# Altium schematic sheet NetworkSwitch.SchDoc
size A2; Organization: Altium Limited; Address1: L3, 12a Rodborough Rd; Address2: Frenchs Forest; Address3: NSW; Address4: Australia 2086
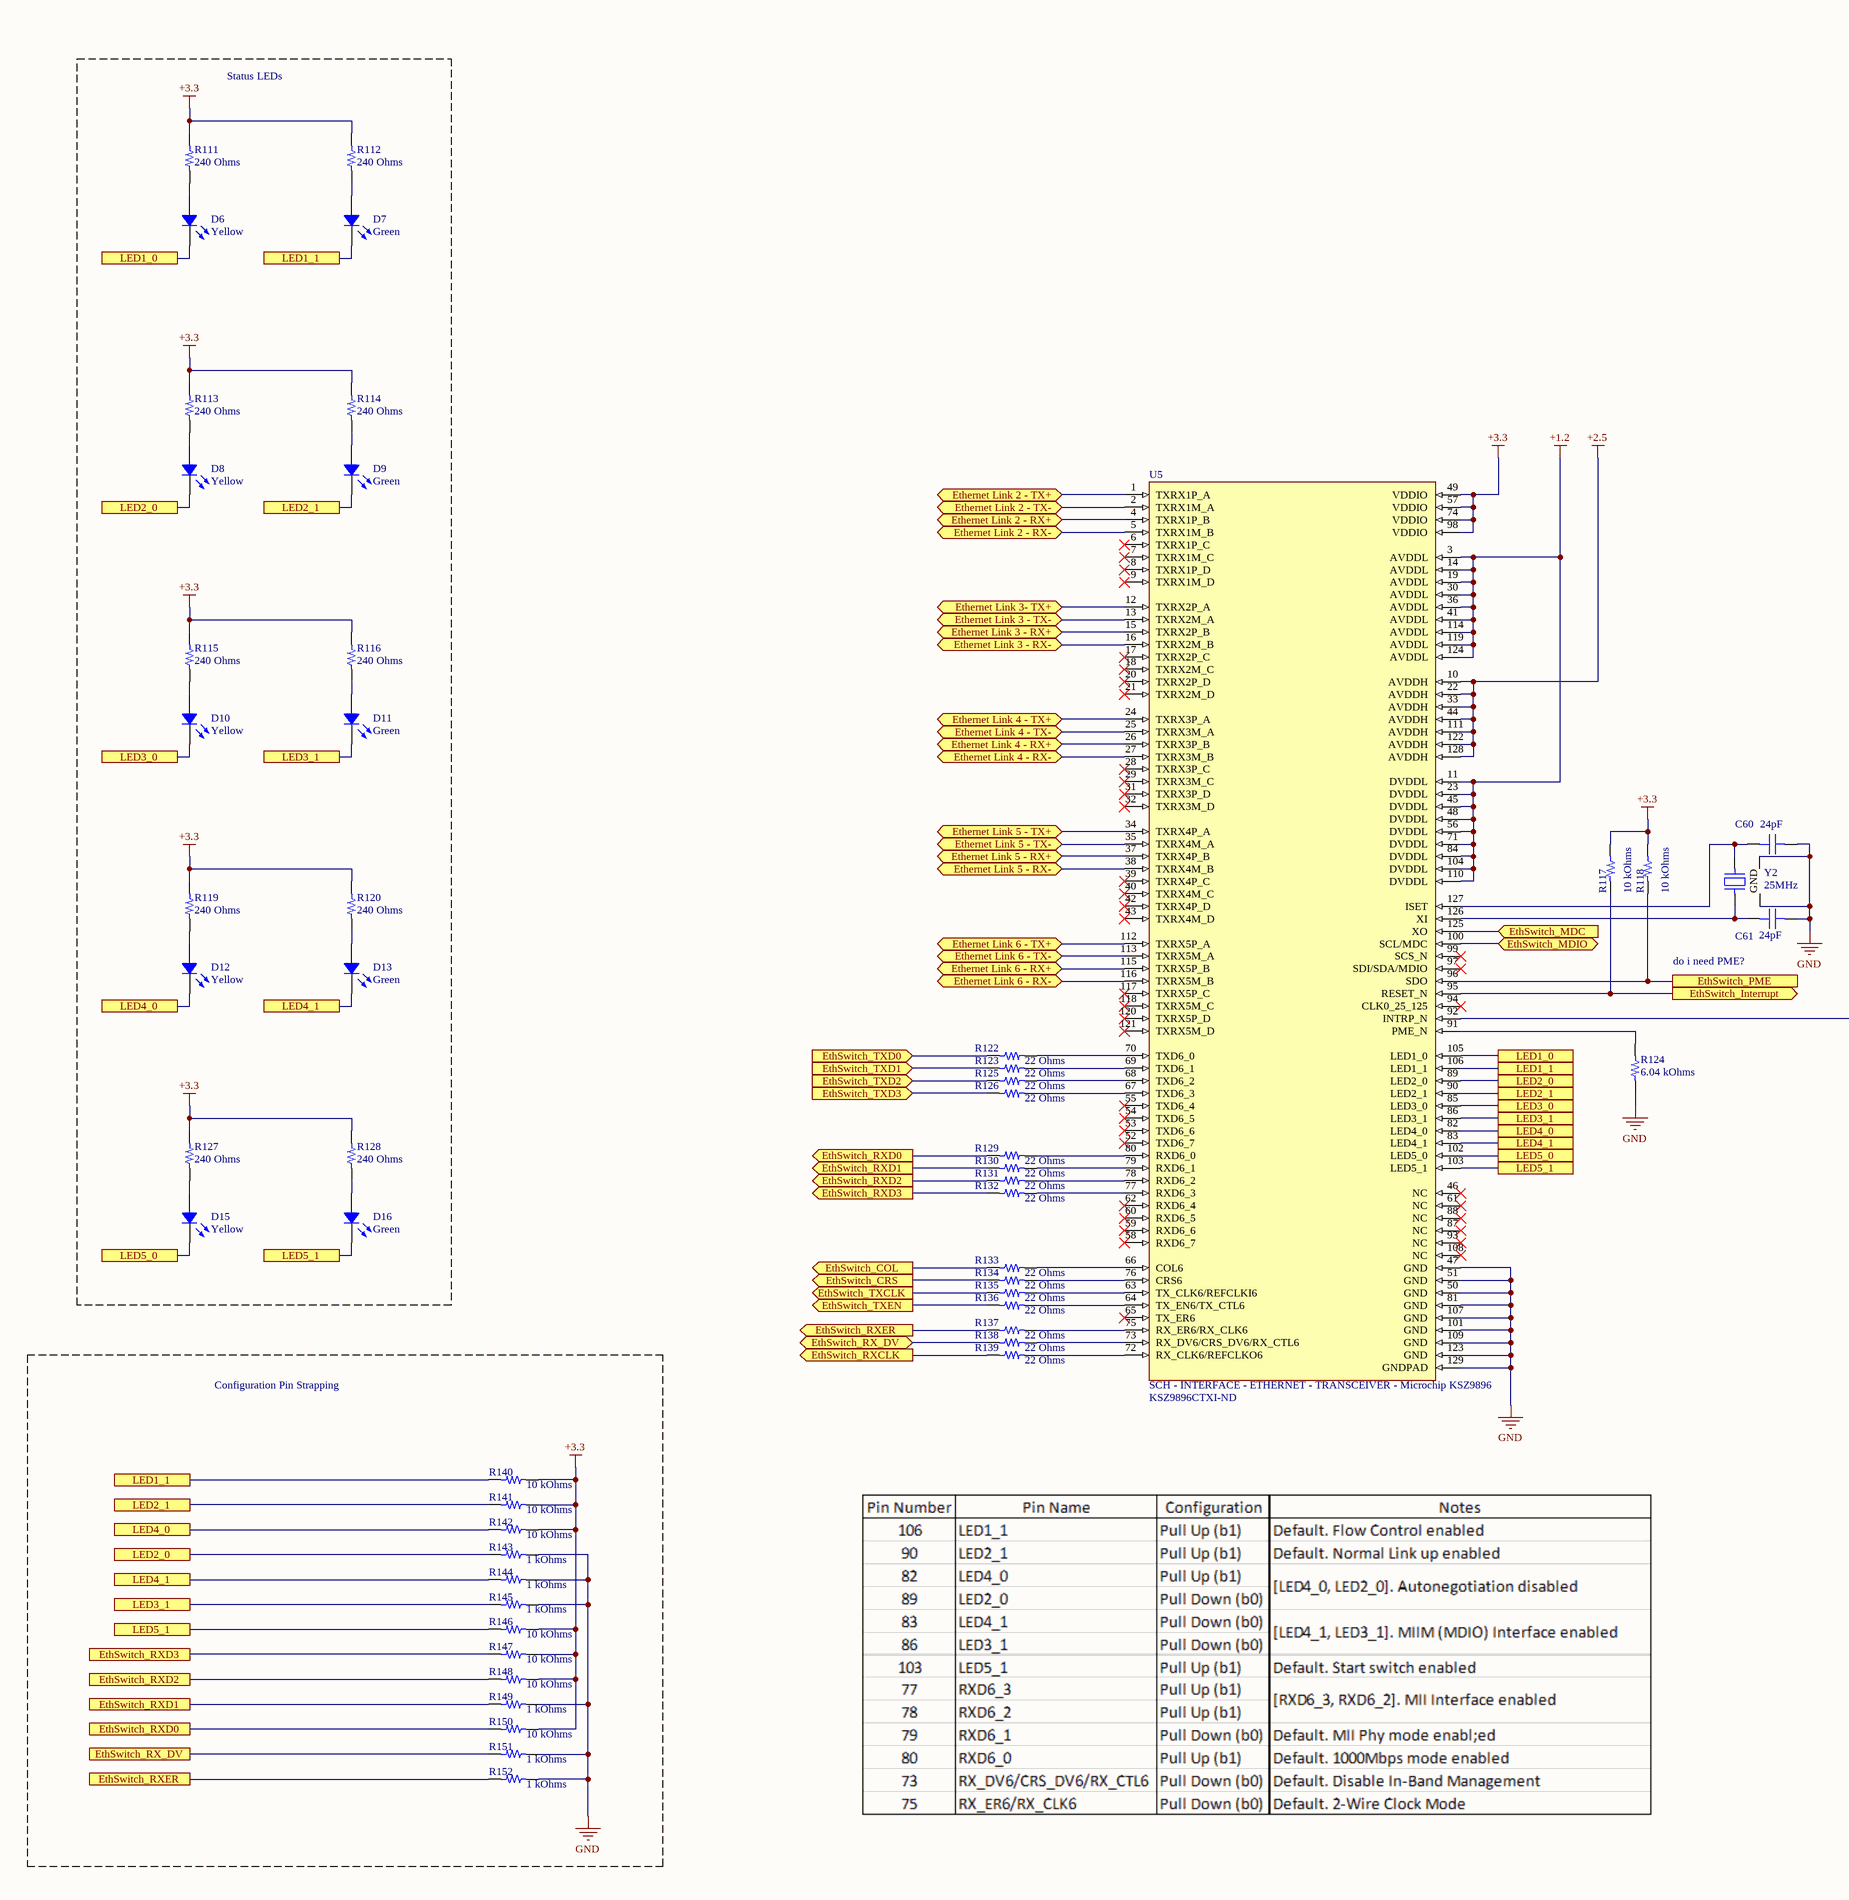
[diagram p0: NetworkSwitch.SchDoc, left]
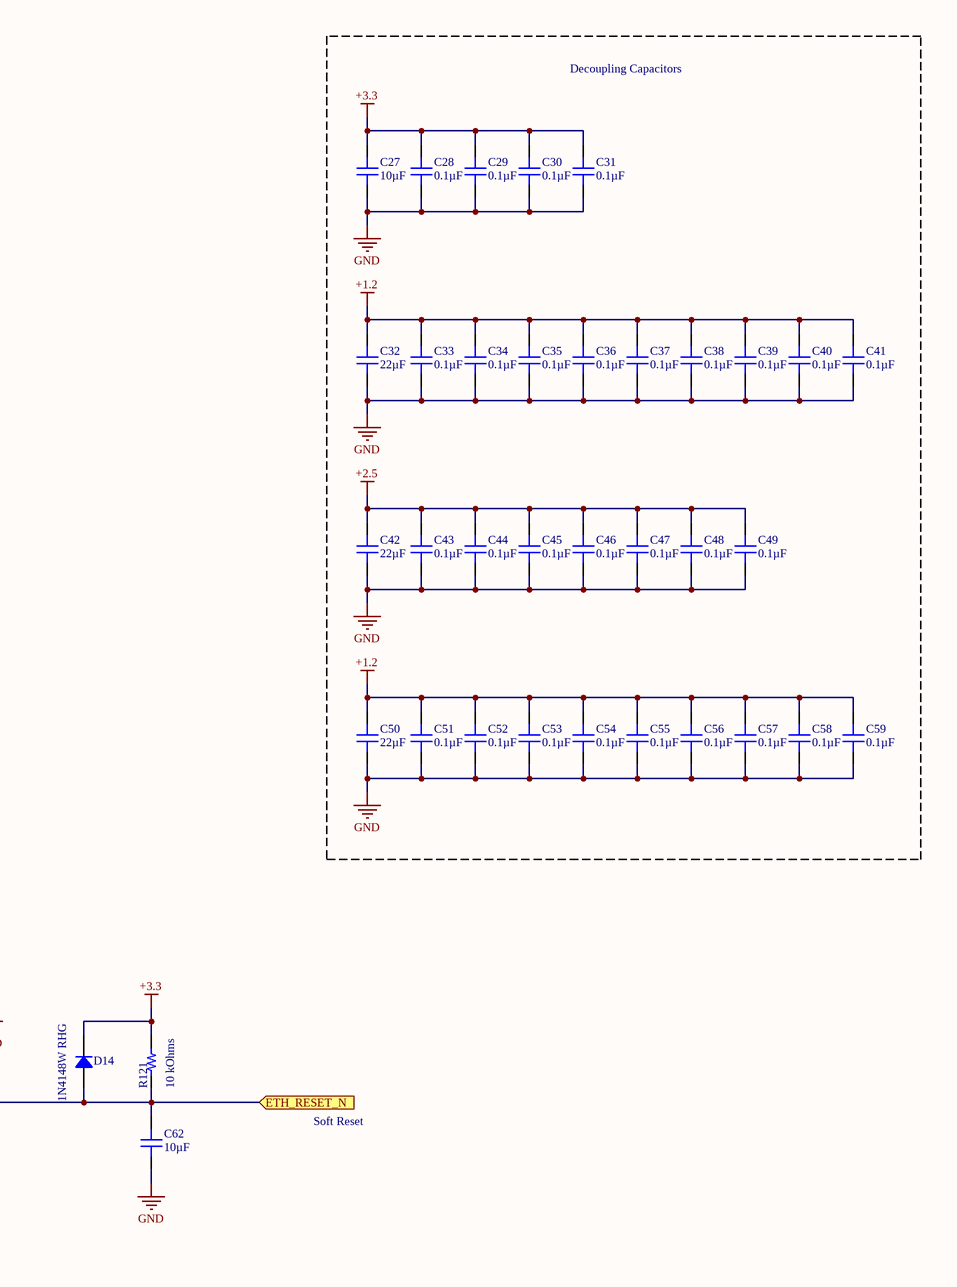
[diagram p1: NetworkSwitch.SchDoc, right]

## Parts
C27  10µF  [CAP 0805_2012]
C28  0.1µF  [CAP 0603_1608]
C29  0.1µF  [CAP 0603_1608]
C30  0.1µF  [CAP 0603_1608]
C31  0.1µF  [CAP 0603_1608]
C32  22µF  [CAP 0805_2012]
C33  0.1µF  [CAP 0603_1608]
C34  0.1µF  [CAP 0603_1608]
C35  0.1µF  [CAP 0603_1608]
C36  0.1µF  [CAP 0603_1608]
C37  0.1µF  [CAP 0603_1608]
C38  0.1µF  [CAP 0603_1608]
C39  0.1µF  [CAP 0603_1608]
C40  0.1µF  [CAP 0603_1608]
C41  0.1µF  [CAP 0603_1608]
C42  22µF  [CAP 0805_2012]
C43  0.1µF  [CAP 0603_1608]
C44  0.1µF  [CAP 0603_1608]
C45  0.1µF  [CAP 0603_1608]
C46  0.1µF  [CAP 0603_1608]
C47  0.1µF  [CAP 0603_1608]
C48  0.1µF  [CAP 0603_1608]
C49  0.1µF  [CAP 0603_1608]
C50  22µF  [CAP 0805_2012]
C51  0.1µF  [CAP 0603_1608]
C52  0.1µF  [CAP 0603_1608]
C53  0.1µF  [CAP 0603_1608]
C54  0.1µF  [CAP 0603_1608]
C55  0.1µF  [CAP 0603_1608]
C56  0.1µF  [CAP 0603_1608]
C57  0.1µF  [CAP 0603_1608]
C58  0.1µF  [CAP 0603_1608]
C59  0.1µF  [CAP 0603_1608]
C60  24pF  [CAP 0603_1608]
C61  24pF  [CAP 0603_1608]
C62  10µF  [CAP 0805_2012]
D6  Yellow  [LED 0603_1608 YELLOW]
D7  Green  [LED 0603_1608 GREEN]
D8  Yellow  [LED 0603_1608 YELLOW]
D9  Green  [LED 0603_1608 GREEN]
D10  Yellow  [LED 0603_1608 YELLOW]
D11  Green  [LED 0603_1608 GREEN]
D12  Yellow  [LED 0603_1608 YELLOW]
D13  Green  [LED 0603_1608 GREEN]
D14  1N4148W RHG  [SOD123F]
D15  Yellow  [LED 0603_1608 YELLOW]
D16  Green  [LED 0603_1608 GREEN]
R111  240 Ohms  [RES 0603_1608]
R112  240 Ohms  [RES 0603_1608]
R113  240 Ohms  [RES 0603_1608]
R114  240 Ohms  [RES 0603_1608]
R115  240 Ohms  [RES 0603_1608]
R116  240 Ohms  [RES 0603_1608]
R117  10 kOhms  [RES 0603_1608]
R118  10 kOhms  [RES 0603_1608]
R119  240 Ohms  [RES 0603_1608]
R120  240 Ohms  [RES 0603_1608]
R121  10 kOhms  [RES 0603_1608]
R122  22 Ohms  [RES 0603_1608]
R123  22 Ohms  [RES 0603_1608]
R124  6.04 kOhms  [RES 0603_1608]
R125  22 Ohms  [RES 0603_1608]
R126  22 Ohms  [RES 0603_1608]
R127  240 Ohms  [RES 0603_1608]
R128  240 Ohms  [RES 0603_1608]
R129  22 Ohms  [RES 0603_1608]
R130  22 Ohms  [RES 0603_1608]
R131  22 Ohms  [RES 0603_1608]
R132  22 Ohms  [RES 0603_1608]
R133  22 Ohms  [RES 0603_1608]
R134  22 Ohms  [RES 0603_1608]
R135  22 Ohms  [RES 0603_1608]
R136  22 Ohms  [RES 0603_1608]
R137  22 Ohms  [RES 0603_1608]
R138  22 Ohms  [RES 0603_1608]
R139  22 Ohms  [RES 0603_1608]
R140  10 kOhms  [RES 0603_1608]
R141  10 kOhms  [RES 0603_1608]
R142  10 kOhms  [RES 0603_1608]
R143  1 kOhms  [RES 0603_1608]
R144  1 kOhms  [RES 0603_1608]
R145  1 kOhms  [RES 0603_1608]
R146  10 kOhms  [RES 0603_1608]
R147  10 kOhms  [RES 0603_1608]
R148  10 kOhms  [RES 0603_1608]
R149  1 kOhms  [RES 0603_1608]
R150  10 kOhms  [RES 0603_1608]
R151  1 kOhms  [RES 0603_1608]
R152  1 kOhms  [RES 0603_1608]
U5  SCH - INTERFACE - ETHERNET - TRANSCEIVER - Microchip KSZ9896  Supplier Part Number 1: KSZ9896CTXI-ND  [PCB - LEADS - QFP - Microchip 128-TQFP]
Y2  25MHz  [EPSON TSX-3225]

## Blocks framed on the sheet
Status LEDs: D6-D13 D15 D16 R111-R116 R119 R120 R127 R128
Decoupling Capacitors: C27-C59
Configuration Pin Strapping: R140-R152

## Ports
ETH_RESET_N (in), Ethernet Link 2 - RX+ (bidir), Ethernet Link 2 - RX- (bidir), Ethernet Link 2 - TX+ (bidir), Ethernet Link 2 - TX- (bidir), Ethernet Link 3 - RX+ (bidir), Ethernet Link 3 - RX- (bidir), Ethernet Link 3 - TX- (bidir), Ethernet Link 3- TX+ (bidir), Ethernet Link 4 - RX+ (bidir), Ethernet Link 4 - RX- (bidir), Ethernet Link 4 - TX+ (bidir), Ethernet Link 4 - TX- (bidir), Ethernet Link 5 - RX+ (bidir), Ethernet Link 5 - RX- (bidir), Ethernet Link 5 - TX+ (bidir), Ethernet Link 5 - TX- (bidir), Ethernet Link 6 - RX+ (bidir), Ethernet Link 6 - RX- (bidir), Ethernet Link 6 - TX+ (bidir), Ethernet Link 6 - TX- (bidir), EthSwitch_COL (out), EthSwitch_CRS (out), EthSwitch_Interrupt (out), EthSwitch_MDC (in), EthSwitch_MDIO (bidir), EthSwitch_PME, EthSwitch_RX_DV, EthSwitch_RX_DV (bidir), EthSwitch_RXCLK (out), EthSwitch_RXD0, EthSwitch_RXD0 (out), EthSwitch_RXD1, EthSwitch_RXD1 (out), EthSwitch_RXD2, EthSwitch_RXD2 (out), EthSwitch_RXD3, EthSwitch_RXD3 (out), EthSwitch_RXER, EthSwitch_RXER (out), EthSwitch_TXCLK (out), EthSwitch_TXD0 (in), EthSwitch_TXD1 (in), EthSwitch_TXD2 (in), EthSwitch_TXD3 (in), EthSwitch_TXEN (out), LED1_0, LED1_1, LED2_0, LED2_1, LED3_0, LED3_1, LED4_0, LED4_1, LED5_0, LED5_1

## Nets
+1.2: C32.2 C33.2 C34.2 C35.2 C36.2 C37.2 C38.2 C39.2 C40.2 C41.2 C50.2 C51.2 C52.2 C53.2 C54.2 C55.2 C56.2 C57.2 C58.2 C59.2 U5.3(AVDDL) U5.11(DVDDL) U5.14(AVDDL) U5.19(AVDDL) U5.23(DVDDL) U5.30(AVDDL) U5.36(AVDDL) U5.41(AVDDL) U5.45(DVDDL) U5.48(DVDDL) U5.56(DVDDL) U5.71(DVDDL) U5.84(DVDDL) U5.104(DVDDL) U5.110(DVDDL) U5.114(AVDDL) U5.119(AVDDL) U5.124(AVDDL)
+2.5: C42.2 C43.2 C44.2 C45.2 C46.2 C47.2 C48.2 C49.2 U5.10(AVDDH) U5.22(AVDDH) U5.33(AVDDH) U5.44(AVDDH) U5.111(AVDDH) U5.122(AVDDH) U5.128(AVDDH)
+3.3: C27.2 C28.2 C29.2 C30.2 C31.2 D14.2 R111.2 R112.2 R113.2 R114.2 R115.2 R116.2 R117.2 R118.2 R119.2 R120.2 R121.2 R127.2 R128.2 R140.1 R141.1 R142.1 R146.1 R147.1 R148.1 R150.1 U5.49(VDDIO) U5.57(VDDIO) U5.74(VDDIO) U5.98(VDDIO)
GND: C27.1 C28.1 C29.1 C30.1 C31.1 C32.1 C33.1 C34.1 C35.1 C36.1 C37.1 C38.1 C39.1 C40.1 C41.1 C42.1 C43.1 C44.1 C45.1 C46.1 C47.1 C48.1 C49.1 C50.1 C51.1 C52.1 C53.1 C54.1 C55.1 C56.1 C57.1 C58.1 C59.1 C60.2 C61.2 C62.1 R124.1 R143.1 R144.1 R145.1 R149.1 R151.1 R152.1 U5.47(GND) U5.50(GND) U5.51(GND) U5.81(GND) U5.101(GND) U5.107(GND) U5.109(GND) U5.123(GND) U5.129(GNDPAD) Y2.2(GND) Y2.4(GND)
ETH_RESET_N: C62.2 D14.1 R121.1 U5.92(INTRP_N) ; port ETH_RESET_N
Ethernet Link 2 - RX+: U5.4(TXRX1P_B) ; port Ethernet Link 2 - RX+
Ethernet Link 2 - RX-: U5.5(TXRX1M_B) ; port Ethernet Link 2 - RX-
Ethernet Link 2 - TX+: U5.1(TXRX1P_A) ; port Ethernet Link 2 - TX+
Ethernet Link 2 - TX-: U5.2(TXRX1M_A) ; port Ethernet Link 2 - TX-
Ethernet Link 3 - RX+: U5.15(TXRX2P_B) ; port Ethernet Link 3 - RX+
Ethernet Link 3 - RX-: U5.16(TXRX2M_B) ; port Ethernet Link 3 - RX-
Ethernet Link 3 - TX-: U5.13(TXRX2M_A) ; port Ethernet Link 3 - TX-
Ethernet Link 3- TX+: U5.12(TXRX2P_A) ; port Ethernet Link 3- TX+
Ethernet Link 4 - RX+: U5.26(TXRX3P_B) ; port Ethernet Link 4 - RX+
Ethernet Link 4 - RX-: U5.27(TXRX3M_B) ; port Ethernet Link 4 - RX-
Ethernet Link 4 - TX+: U5.24(TXRX3P_A) ; port Ethernet Link 4 - TX+
Ethernet Link 4 - TX-: U5.25(TXRX3M_A) ; port Ethernet Link 4 - TX-
Ethernet Link 5 - RX+: U5.37(TXRX4P_B) ; port Ethernet Link 5 - RX+
Ethernet Link 5 - RX-: U5.38(TXRX4M_B) ; port Ethernet Link 5 - RX-
Ethernet Link 5 - TX+: U5.34(TXRX4P_A) ; port Ethernet Link 5 - TX+
Ethernet Link 5 - TX-: U5.35(TXRX4M_A) ; port Ethernet Link 5 - TX-
Ethernet Link 6 - RX+: U5.115(TXRX5P_B) ; port Ethernet Link 6 - RX+
Ethernet Link 6 - RX-: U5.116(TXRX5M_B) ; port Ethernet Link 6 - RX-
Ethernet Link 6 - TX+: U5.112(TXRX5P_A) ; port Ethernet Link 6 - TX+
Ethernet Link 6 - TX-: U5.113(TXRX5M_A) ; port Ethernet Link 6 - TX-
EthSwitch_COL: R133.1 ; port EthSwitch_COL
EthSwitch_CRS: R134.1 ; port EthSwitch_CRS
EthSwitch_Interrupt: R117.1 U5.95(RESET_N) ; port EthSwitch_Interrupt
EthSwitch_MDC: U5.125(XO) ; port EthSwitch_MDC
EthSwitch_MDIO: U5.100(SCL/MDC) ; port EthSwitch_MDIO
EthSwitch_PME: R118.1 U5.96(SDO) ; port EthSwitch_PME
EthSwitch_RX_DV: R138.1 R151.2 ; port EthSwitch_RX_DV
EthSwitch_RXCLK: R139.1 ; port EthSwitch_RXCLK
EthSwitch_RXD0: R129.1 R150.2 ; port EthSwitch_RXD0
EthSwitch_RXD1: R130.1 R149.2 ; port EthSwitch_RXD1
EthSwitch_RXD2: R131.1 R148.2 ; port EthSwitch_RXD2
EthSwitch_RXD3: R132.1 R147.2 ; port EthSwitch_RXD3
EthSwitch_RXER: R137.1 R152.2 ; port EthSwitch_RXER
EthSwitch_TXCLK: R135.1 ; port EthSwitch_TXCLK
EthSwitch_TXD0: R122.1 ; port EthSwitch_TXD0
EthSwitch_TXD1: R123.1 ; port EthSwitch_TXD1
EthSwitch_TXD2: R125.1 ; port EthSwitch_TXD2
EthSwitch_TXD3: R126.1 ; port EthSwitch_TXD3
EthSwitch_TXEN: R136.1 ; port EthSwitch_TXEN
LED1_0: D6.2 U5.105(LED1_0) ; port LED1_0
LED1_1: D7.2 R140.2 U5.106(LED1_1) ; port LED1_1
LED2_0: D8.2 R143.2 U5.89(LED2_0) ; port LED2_0
LED2_1: D9.2 R141.2 U5.90(LED2_1) ; port LED2_1
LED3_0: D10.2 U5.85(LED3_0) ; port LED3_0
LED3_1: D11.2 R145.2 U5.86(LED3_1) ; port LED3_1
LED4_0: D12.2 R142.2 U5.82(LED4_0) ; port LED4_0
LED4_1: D13.2 R144.2 U5.83(LED4_1) ; port LED4_1
LED5_0: D15.2 U5.102(LED5_0) ; port LED5_0
LED5_1: D16.2 R146.2 U5.103(LED5_1) ; port LED5_1
NetC60_1: C60.1 U5.127(ISET) Y2.3
NetC61_1: C61.1 U5.126(XI) Y2.1
NetD6_1: D6.1 R111.1
NetD7_1: D7.1 R112.1
NetD8_1: D8.1 R113.1
NetD9_1: D9.1 R114.1
NetD10_1: D10.1 R115.1
NetD11_1: D11.1 R116.1
NetD12_1: D12.1 R119.1
NetD13_1: D13.1 R120.1
NetD15_1: D15.1 R127.1
NetD16_1: D16.1 R128.1
NetR122_2: R122.2 U5.70(TXD6_0)
NetR123_2: R123.2 U5.69(TXD6_1)
NetR124_2: R124.2 U5.91(PME_N)
NetR125_2: R125.2 U5.68(TXD6_2)
NetR126_2: R126.2 U5.67(TXD6_3)
NetR129_2: R129.2 U5.80(RXD6_0)
NetR130_2: R130.2 U5.79(RXD6_1)
NetR131_2: R131.2 U5.78(RXD6_2)
NetR132_2: R132.2 U5.77(RXD6_3)
NetR133_2: R133.2 U5.66(COL6)
NetR134_2: R134.2 U5.76(CRS6)
NetR135_2: R135.2 U5.63(TX_CLK6/REFCLKI6)
NetR136_2: R136.2 U5.64(TX_EN6/TX_CTL6)
NetR137_2: R137.2 U5.75(RX_ER6/RX_CLK6)
NetR138_2: R138.2 U5.73(RX_DV6/CRS_DV6/RX_CTL6)
NetR139_2: R139.2 U5.72(RX_CLK6/REFCLKO6)

Not connected (* = marked no-connect by the designer): U5 6(TXRX1P_C)* 7(TXRX1M_C)* 8(TXRX1P_D)* 9(TXRX1M_D)* 17(TXRX2P_C)* 18(TXRX2M_C)* 20(TXRX2P_D)* 21(TXRX2M_D)* 28(TXRX3P_C)* 29(TXRX3M_C)* 31(TXRX3P_D)* 32(TXRX3M_D)* 39(TXRX4P_C)* 40(TXRX4M_C)* 42(TXRX4P_D)* 43(TXRX4M_D)* 46(NC)* 52(TXD6_7)* 53(TXD6_6)* 54(TXD6_5)* 55(TXD6_4)* 58(RXD6_7)* 59(RXD6_6)* 60(RXD6_5)* 61(NC)* 62(RXD6_4)* 65(TX_ER6)* 87(NC)* 88(NC)* 93(NC)* 94(CLK0_25_125)* 97(SDI/SDA/MDIO)* 99(SCS_N)* 108(NC)* 117(TXRX5P_C)* 118(TXRX5M_C)* 120(TXRX5P_D)* 121(TXRX5M_D)*

## Notes on the sheet
- (near C61) do i need PME?
- Soft Reset
- Title
- Size:
- Date:
- File:
- A2
- Number:
- Time:
- Revision:
- Sheet
- of

## Library data of the parts
C27 C62 = CC0805KKX5R7BB106: CAP CER 10UF 16V X5R 0805; Manufacturer: Yageo; Tolerance: ±10%; Part Number: CC0805KKX5R7BB106; Value: 10µF; Applications: General Purpose; Capacitance: 10µF; ComponentLink1Description: Datasheet; ComponentLink1URL: https://www.yageo.com/upload/media/product/productsearch/datasheet/mlcc/UPY-GPHC_X5R_4V-to-50V_25.pdf; ComponentLink2Description: DigiKey Link; ComponentLink2URL: http://digikey.com/product-detail/en/yageo/CC0805KKX5R7BB106/311-1865-1-ND/5195767; Device Package: 0805 (2012 Metric); LastUpdated: 9/2/2020 1:04:30 AM; Lifecycle Status: Active; Minimum Order: 1; Mounting Type: Surface Mount, MLCC; Operating Temperature: -55°C ~ 85°C; Package / Case: 0805 (2012 Metric); Packaging: TapeAndReel; PartId: 8867; Part Status: Active; Price: 0.09; Series: CC; Size / Dimension: 0.079" L x 0.049" W (2.00mm x 1.25mm); Supplier 1: DigiKey; Supplier Part Number 1: 311-1865-1-ND; Temperature Coefficient: X5R; Thickness (Max): 0.057" (1.45mm); Voltage - Rated: 16V
C28-C31 C33-C41 C43-C49 C51-C59 = CL10B104KA8WPNC: CAP CER 0.1UF 25V X7R 0603; Manufacturer: Samsung Electro-Mechanics; Tolerance: ±10%; Part Number: CL10B104KA8WPNC; Value: 0.1µF; Applications: Automotive; Capacitance: 0.1µF; ComponentLink1Description: Datasheet; ComponentLink1URL: http://www.samsungsem.com/kr/support/product-search/mlcc/CL10B104KA8WPNC.jsp; ComponentLink2Description: DigiKey Link; ComponentLink2URL: http://digikey.com/product-detail/en/samsung-electro-mechanics/CL10B104KA8WPNC/1276-6717-1-ND/5961576; Device Package: 0603 (1608 Metric); Features: Open Mode; LastUpdated: 9/2/2020 1:03:30 AM; Lifecycle Status: Active; Minimum Order: 1; Mounting Type: Surface Mount, MLCC; Operating Temperature: -55°C ~ 125°C; Package / Case: 0603 (1608 Metric); Packaging: TapeAndReel; PartId: 5631; Part Status: Active; Price: 0.02; Ratings: AEC-Q200; Series: CL; Size / Dimension: 0.063" L x 0.031" W (1.60mm x 0.80mm); Supplier 1: DigiKey; Supplier Part Number 1: 1276-6717-1-ND; Temperature Coefficient: X7R; Thickness (Max): 0.035" (0.90mm); Voltage - Rated: 25V
C32 C42 C50 = CL21A226KPCLRNC: CAP CER 22UF 10V X5R 0805; Manufacturer: Samsung Electro-Mechanics; Tolerance: ±10%; Part Number: CL21A226KPCLRNC; Value: 22µF; Applications: General Purpose; Capacitance: 22µF; ComponentLink1Description: Datasheet; ComponentLink1URL: http://www.samsungsem.com/kr/support/product-search/mlcc/CL21A226KPCLRNC.jsp; ComponentLink2Description: DigiKey Link; ComponentLink2URL: http://digikey.com/product-detail/en/samsung-electro-mechanics/CL21A226KPCLRNC/1276-6786-1-ND/5961645; Device Package: 0805 (2012 Metric); Features: Low Profile; LastUpdated: 9/2/2020 1:04:38 AM; Lifecycle Status: Active; Minimum Order: 1; Mounting Type: Surface Mount, MLCC; Operating Temperature: -55°C ~ 85°C; Package / Case: 0805 (2012 Metric); Packaging: TapeAndReel; PartId: 4833; Part Status: Active; Price: 0.08; Series: CL; Size / Dimension: 0.079" L x 0.049" W (2.00mm x 1.25mm); Supplier 1: DigiKey; Supplier Part Number 1: 1276-6786-1-ND; Temperature Coefficient: X5R; Thickness (Max): 0.037" (0.95mm); Voltage - Rated: 10V
C60 C61 = CL10C240JB8NNNC: CAP CER 24PF 50V C0G/NP0 0603; Manufacturer: Samsung Electro-Mechanics; Temperature Coefficient: C0G, NP0; Tolerance: ±5%; Part Number: CL10C240JB8NNNC; Value: 24pF; Applications: General Purpose; Capacitance: 24pF; ComponentLink1Description: Datasheet; ComponentLink1URL: http://www.samsungsem.com/kr/support/product-search/mlcc/CL10C240JB8NNNC.jsp; ComponentLink2Description: DigiKey Link; ComponentLink2URL: http://digikey.com/product-detail/en/samsung-electro-mechanics/CL10C240JB8NNNC/1276-1761-1-ND/3889847; Device Package: 0603 (1608 Metric); LastUpdated: 9/2/2020 1:03:22 AM; Lifecycle Status: Active; Minimum Order: 1; Mounting Type: Surface Mount, MLCC; Operating Temperature: -55°C ~ 125°C; Package / Case: 0603 (1608 Metric); Packaging: TapeAndReel; PartId: 10003; Part Status: Active; Price: 0.01; Series: CL; Size / Dimension: 0.063" L x 0.031" W (1.60mm x 0.80mm); Supplier 1: DigiKey; Supplier Part Number 1: 1276-1761-1-ND; Thickness (Max): 0.035" (0.90mm); Voltage - Rated: 50V
D6 D8 D10 D12 D15 = LTST-C194KSKT: LED YELLOW CLEAR SMD; Manufacturer: Lite-On Inc.; Configuration: Standard; Current - Test: 20mA; Lens Color: Colorless; Lens Size: 1.15mm x 0.80mm; Lens Style: Rectangle with Flat Top; Millicandela Rating: 104mcd; Viewing Angle: 130°; Voltage - Forward (Vf) (Typ): 2V; Wavelength - Dominant: 592nm; Wavelength - Peak: 588nm; Part Number: LTST-C194KSKT; Color: Yellow; ComponentLink1Description: Datasheet; ComponentLink1URL: http://optoelectronics.liteon.com/upload/download/DS22-2006-114/LTST-C194KSKT.PDF; ComponentLink2Description: DigiKey Link; ComponentLink2URL: http://digikey.com/product-detail/en/lite-on-inc/LTST-C194KSKT/160-1836-1-ND/2356234; Device Package: 0603 (1608 Metric); Height (Max): 0.45mm; LastUpdated: 9/2/2020 1:21:17 AM; Lens Transparency: Clear; Lifecycle Status: Active; Minimum Order: 1; Mounting Type: Surface Mount; Package / Case: 0603 (1608 Metric); Packaging: TapeAndReel; PartId: 148; Part Status: Active; Price: 0.06; Series: -; Size / Dimension: 1.60mm L x 0.80mm W; Supplier 1: DigiKey; Supplier Part Number 1: 160-1836-1-ND; Value: Yellow
D7 D9 D11 D13 D16 = LTST-C193KGKT-5A: LED GREEN CLEAR CHIP SMD; Manufacturer: Lite-On Inc.; Configuration: Standard; Current - Test: 5mA; Lens Color: Colorless; Lens Size: 1.15mm x 0.80mm; Lens Style: Rectangle with Flat Top; Millicandela Rating: 16.25mcd; Viewing Angle: 130°; Voltage - Forward (Vf) (Typ): 2V; Wavelength - Dominant: 572nm; Wavelength - Peak: 574nm; Part Number: LTST-C193KGKT-5A; Color: Green; ComponentLink1Description: Datasheet; ComponentLink1URL: http://optoelectronics.liteon.com/upload/download/DS22-2007-0094/LTST-C193KGKT-5A.PDF; ComponentLink2Description: DigiKey Link; ComponentLink2URL: http://digikey.com/product-detail/en/lite-on-inc/LTST-C193KGKT-5A/160-1828-1-ND/2356247; Device Package: 0603 (1608 Metric); Height (Max): 0.45mm; LastUpdated: 9/2/2020 1:20:41 AM; Lens Transparency: Clear; Lifecycle Status: Active; Minimum Order: 1; Mounting Type: Surface Mount; Package / Case: 0603 (1608 Metric); Packaging: TapeAndReel; PartId: 694; Part Status: Active; Price: 0.06; Series: -; Size / Dimension: 1.60mm L x 0.80mm W; Supplier 1: DigiKey; Supplier Part Number 1: 160-1828-1-ND; Supplier Device Package: Chip LED; Value: Green
D14 = 1N4148W RHG: DIODE GEN PURP 100V 150MA SOD123; Manufacturer: Taiwan Semiconductor Corporation; Current - Average Rectified (Io): 150mA (DC); Current - Reverse Leakage @ Vr: 5µA @ 75V; Diode Type: Standard; Reverse Recovery Time (trr): 4ns; Speed: Fast Recovery =< 500ns, > 200mA (Io); Voltage - Forward (Vf) (Max) @ If: 1V @ 100mA; Part Number: 1N4148W RHG; ComponentLink1Description: Datasheet; ComponentLink1URL: https://www.taiwansemi.com/products/datasheet/1N4148W%20SERIES_K1804.pdf; ComponentLink2Description: DigiKey Link; ComponentLink2URL: http://digikey.com/product-detail/en/taiwan-semiconductor-corporation/1N4148W-RHG/1N4148WRHGCT-ND/7357066; LastUpdated: 9/2/2020 1:19:10 AM; Lifecycle Status: Active; Minimum Order: 1; Mounting Type: Surface Mount; Operating Temperature - Junction: -65°C ~ 150°C; Package / Case: SOD-123F; Packaging: TapeAndReel; PartId: 1073; Part Status: Active; Price: 0.03; Series: -; Supplier 1: DigiKey; Supplier Part Number 1: 1N4148WRHGCT-ND; Supplier Device Package: SOD-123F; Voltage - DC Reverse (Vr) (Max): 100V
R111-R116 R119 R120 R127 R128 = RMCF0603JT240R: RES 240 OHM 5% 1/10W 0603; Manufacturer: Stackpole Electronics Inc; Power (Watts): 0.1W, 1/10W; Temperature Coefficient: ±200ppm/°C; Part Number: RMCF0603JT240R; Value: 240 Ohms; ComponentLink1Description: Datasheet; ComponentLink1URL: https://www.seielect.com/catalog/sei-rmcf_rmcp.pdf; ComponentLink2Description: DigiKey Link; ComponentLink2URL: http://digikey.com/product-detail/en/stackpole-electronics-inc/RMCF0603JT240R/RMCF0603JT240RCT-ND/2418189; Composition: Thick Film; Device Package: 0603 (1608 Metric); Features: Automotive AEC-Q200; Height - Seated (Max): 0.022" (0.55mm); LastUpdated: 9/2/2020 1:10:22 AM; Lifecycle Status: Active; Minimum Order: 1; Number of Terminations: 2; Operating Temperature: -55°C ~ 155°C; Package / Case: 0603 (1608 Metric); Packaging: CutTape; PartId: 5995; Part Status: Active; Price: 0.10; Ratings: AEC-Q200; Resistance: 240 Ohms; Series: RMCF; Size / Dimension: 0.061" L x 0.031" W (1.55mm x 0.80mm); Supplier 1: DigiKey; Supplier Part Number 1: RMCF0603JT240RCT-ND; Supplier Device Package: 0603; Tolerance: ±5%
R117 R118 R121 R140-R142 R146-R148 R150 = RMCF0603JT10K0: RES 10K OHM 5% 1/10W 0603; Manufacturer: Stackpole Electronics Inc; Power (Watts): 0.1W, 1/10W; Temperature Coefficient: ±200ppm/°C; Part Number: RMCF0603JT10K0; Value: 10 kOhms; ComponentLink1Description: Datasheet; ComponentLink1URL: https://www.seielect.com/catalog/sei-packaging.pdf; ComponentLink2Description: DigiKey Link; ComponentLink2URL: http://digikey.com/product-detail/en/stackpole-electronics-inc/RMCF0603JT10K0/RMCF0603JT10K0CT-ND/1943191; Composition: Thick Film; Device Package: 0603 (1608 Metric); Features: Automotive AEC-Q200; Height - Seated (Max): 0.022" (0.55mm); LastUpdated: 8/30/2020 8:48:45 PM; Lifecycle Status: Active; Minimum Order: 1; Number of Terminations: 2; Operating Temperature: -55°C ~ 155°C; Package / Case: 0603 (1608 Metric); Packaging: CutTape; PartId: 25659; Part Status: Active; Price: 0.10; Ratings: AEC-Q200; Resistance: 10 kOhms; Series: RMCF; Size / Dimension: 0.061" L x 0.031" W (1.55mm x 0.80mm); Supplier 1: DigiKey; Supplier Part Number 1: RMCF0603JT10K0CT-ND; Supplier Device Package: 0603; Tolerance: ±5%
R122 R123 R125 R126 R129-R139 = RMCF0603FT22R0: RES 22 OHM 1% 1/10W 0603; Manufacturer: Stackpole Electronics Inc; Power (Watts): 0.1W, 1/10W; Temperature Coefficient: ±100ppm/°C; Part Number: RMCF0603FT22R0; Value: 22 Ohms; ComponentLink1Description: Datasheet; ComponentLink1URL: https://www.seielect.com/catalog/sei-packaging.pdf; ComponentLink2Description: DigiKey Link; ComponentLink2URL: http://digikey.com/product-detail/en/stackpole-electronics-inc/RMCF0603FT22R0/RMCF0603FT22R0CT-ND/1942946; Composition: Thick Film; Device Package: 0603 (1608 Metric); Features: Automotive AEC-Q200; Height - Seated (Max): 0.022" (0.55mm); LastUpdated: 9/2/2020 1:10:13 AM; Lifecycle Status: Active; Minimum Order: 1; Number of Terminations: 2; Operating Temperature: -55°C ~ 155°C; Package / Case: 0603 (1608 Metric); Packaging: CutTape; PartId: 10611; Part Status: Active; Price: 0.10; Ratings: AEC-Q200; Resistance: 22 Ohms; Series: RMCF; Size / Dimension: 0.061" L x 0.031" W (1.55mm x 0.80mm); Supplier 1: DigiKey; Supplier Part Number 1: RMCF0603FT22R0CT-ND; Supplier Device Package: 0603; Tolerance: ±1%
R124 = RMCF0603FT6K04: RES 6.04K OHM 1% 1/10W 0603; Manufacturer: Stackpole Electronics Inc; Power (Watts): 0.1W, 1/10W; Temperature Coefficient: ±100ppm/°C; Part Number: RMCF0603FT6K04; Value: 6.04 kOhms; ComponentLink1Description: Datasheet; ComponentLink1URL: https://www.seielect.com/catalog/sei-rmcf_rmcp.pdf; ComponentLink2Description: DigiKey Link; ComponentLink2URL: http://digikey.com/product-detail/en/stackpole-electronics-inc/RMCF0603FT6K04/RMCF0603FT6K04CT-ND/1943041; Composition: Thick Film; Device Package: 0603 (1608 Metric); Features: Automotive AEC-Q200; Height - Seated (Max): 0.022" (0.55mm); LastUpdated: 9/2/2020 1:10:13 AM; Lifecycle Status: Active; Minimum Order: 1; Number of Terminations: 2; Operating Temperature: -55°C ~ 155°C; Package / Case: 0603 (1608 Metric); Packaging: CutTape; PartId: 10873; Part Status: Active; Price: 0.10; Ratings: AEC-Q200; Resistance: 6.04 kOhms; Series: RMCF; Size / Dimension: 0.061" L x 0.031" W (1.55mm x 0.80mm); Supplier 1: DigiKey; Supplier Part Number 1: RMCF0603FT6K04CT-ND; Supplier Device Package: 0603; Tolerance: ±1%
R143-R145 R149 R151 R152 = RNCP0603FTD1K00: RES 1K OHM 1% 1/8W 0603; Manufacturer: Stackpole Electronics Inc; Power (Watts): 0.125W, 1/8W; Temperature Coefficient: ±100ppm/°C; Part Number: RNCP0603FTD1K00; Value: 1 kOhms; ComponentLink1Description: Datasheet; ComponentLink1URL: https://www.seielect.com/catalog/sei-rncp.pdf; ComponentLink2Description: DigiKey Link; ComponentLink2URL: http://digikey.com/product-detail/en/stackpole-electronics-inc/RNCP0603FTD1K00/RNCP0603FTD1K00CT-ND/2240445; Composition: Thin Film; Device Package: 0603 (1608 Metric); Features: Anti-Sulfur, Moisture Resistant; Height - Seated (Max): 0.020" (0.50mm); LastUpdated: 9/2/2020 1:10:23 AM; Lifecycle Status: Active; Minimum Order: 1; Number of Terminations: 2; Operating Temperature: -55°C ~ 155°C; Package / Case: 0603 (1608 Metric); Packaging: TapeAndReel; PartId: 5694; Part Status: Active; Price: 0.01; Resistance: 1 kOhms; Series: RNCP; Size / Dimension: 0.059" L x 0.031" W (1.50mm x 0.80mm); Supplier 1: DigiKey; Supplier Part Number 1: RNCP0603FTD1K00CT-ND; Supplier Device Package: 0603; Tolerance: ±1%
Y2 = TSX-3225 25.0000MF20P-C0: CRYSTAL 25.0000MHZ 18PF SMD; Manufacturer: EPSON; ESR (Equivalent Series Resistance): 40 Ohms; Frequency Stability: ±20ppm; Frequency Tolerance: ±10ppm; Operating Mode: Fundamental; Part Number: TSX-3225 25.0000MF20P-C0; ComponentLink1Description: Datasheet; ComponentLink1URL: https://support.epson.biz/td/api/doc_check.php?dl=brief_TSX-3225&lang=en; ComponentLink2Description: DigiKey Link; ComponentLink2URL: http://digikey.com/product-detail/en/epson/TSX-3225-25.0000MF20P-C0/SER4212CT-ND/7430967; Frequency: 25MHz; Height - Seated (Max): 0.024" (0.60mm); LastUpdated: 9/2/2020 1:21:54 AM; Lifecycle Status: Active; Load Capacitance: 18pF; Minimum Order: 1; Mounting Type: Surface Mount; Operating Temperature: -20°C ~ 85°C; Package / Case: 4-SMD, No Lead; Packaging: TapeAndReel; PartId: 447; Part Status: Active; Price: 0.18; Series: TSX-3225; Size / Dimension: 0.126" L x 0.098" W (3.20mm x 2.50mm); Supplier 1: DigiKey; Supplier Part Number 1: SER4212CT-ND; Type: MHz Crystal; Value: 25MHz
U5 = SCH - INTERFACE - ETHERNET - TRANSCEIVER - Microchip KSZ9896: Supplier 1: Digi-Key